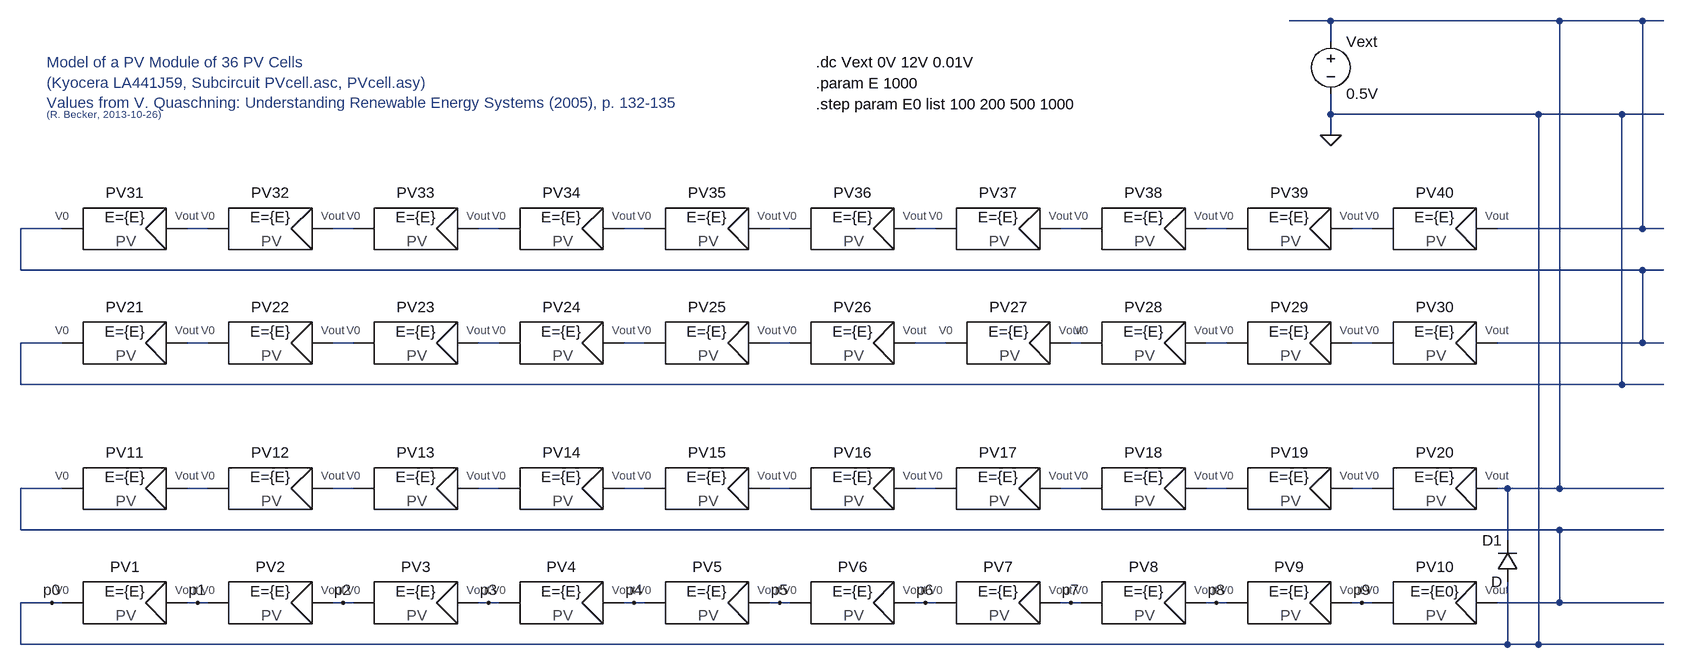
[diagram p0: schematic PVmodule_40Cells_V002.asc]
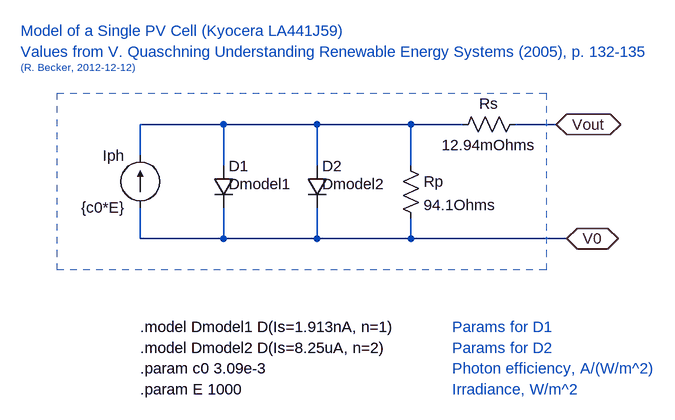
[diagram p1: sub-circuit pvcell.asc]
PVmodule_40Cells_V002.asc, the LTspice schematic file:
Version 4
SHEET 1 2048 1588
WIRE 1440 -16 1376 -16
WIRE 1792 -16 1440 -16
WIRE 1920 -16 1792 -16
WIRE 1952 -16 1920 -16
WIRE 1440 16 1440 -16
WIRE 1440 128 1440 96
WIRE 1760 128 1440 128
WIRE 1888 128 1760 128
WIRE 1952 128 1888 128
WIRE 1440 160 1440 128
WIRE -512 304 -576 304
WIRE -288 304 -320 304
WIRE -64 304 -96 304
WIRE 160 304 128 304
WIRE 384 304 352 304
WIRE 608 304 576 304
WIRE 832 304 800 304
WIRE 1056 304 1024 304
WIRE 1280 304 1248 304
WIRE 1504 304 1472 304
WIRE 1920 304 1920 -16
WIRE 1920 304 1696 304
WIRE 1952 304 1920 304
WIRE -576 368 -576 304
WIRE 1920 368 -576 368
WIRE 1952 368 1920 368
WIRE -512 480 -576 480
WIRE -288 480 -320 480
WIRE -64 480 -96 480
WIRE 160 480 128 480
WIRE 384 480 352 480
WIRE 608 480 576 480
WIRE 848 480 800 480
WIRE 1056 480 1040 480
WIRE 1280 480 1248 480
WIRE 1504 480 1472 480
WIRE 1920 480 1920 368
WIRE 1920 480 1696 480
WIRE 1952 480 1920 480
WIRE -576 544 -576 480
WIRE 1888 544 1888 128
WIRE 1888 544 -576 544
WIRE 1952 544 1888 544
WIRE -512 704 -576 704
WIRE -288 704 -320 704
WIRE -64 704 -96 704
WIRE 160 704 128 704
WIRE 384 704 352 704
WIRE 608 704 576 704
WIRE 832 704 800 704
WIRE 1056 704 1024 704
WIRE 1280 704 1248 704
WIRE 1504 704 1472 704
WIRE 1712 704 1696 704
WIRE 1792 704 1792 -16
WIRE 1792 704 1712 704
WIRE 1952 704 1792 704
WIRE -576 768 -576 704
WIRE 1792 768 -576 768
WIRE 1952 768 1792 768
WIRE 1712 784 1712 704
WIRE -528 880 -576 880
WIRE -512 880 -528 880
WIRE -304 880 -320 880
WIRE -288 880 -304 880
WIRE -80 880 -96 880
WIRE -64 880 -80 880
WIRE 144 880 128 880
WIRE 160 880 144 880
WIRE 368 880 352 880
WIRE 384 880 368 880
WIRE 592 880 576 880
WIRE 608 880 592 880
WIRE 816 880 800 880
WIRE 832 880 816 880
WIRE 1040 880 1024 880
WIRE 1056 880 1040 880
WIRE 1264 880 1248 880
WIRE 1280 880 1264 880
WIRE 1488 880 1472 880
WIRE 1504 880 1488 880
WIRE 1792 880 1792 768
WIRE 1792 880 1696 880
WIRE 1952 880 1792 880
WIRE -576 944 -576 880
WIRE 1712 944 1712 848
WIRE 1712 944 -576 944
WIRE 1760 944 1760 128
WIRE 1760 944 1712 944
WIRE 1952 944 1760 944
FLAG 1440 160 0
FLAG -528 880 p0
FLAG -304 880 p1
FLAG -80 880 p2
FLAG 144 880 p3
FLAG 368 880 p4
FLAG 592 880 p5
FLAG 816 880 p6
FLAG 1040 880 p7
FLAG 1264 880 p8
FLAG 1488 880 p9
SYMBOL PVcell -416 880 R0
WINDOW 39 0 -2 Bottom 2
SYMATTR SpiceLine E={E}
SYMATTR InstName PV1
SYMATTR SpiceModel ""
SYMBOL voltage 1440 0 R0
WINDOW 123 0 0 Left 2
WINDOW 39 0 0 Left 2
SYMATTR InstName Vext
SYMATTR Value 0.5V
SYMBOL PVcell -192 880 R0
WINDOW 39 0 -2 Bottom 2
SYMATTR SpiceLine E={E}
SYMATTR InstName PV2
SYMATTR SpiceModel ""
SYMBOL PVcell 32 880 R0
WINDOW 39 0 -2 Bottom 2
SYMATTR SpiceLine E={E}
SYMATTR InstName PV3
SYMATTR SpiceModel ""
SYMBOL PVcell 256 880 R0
WINDOW 39 0 -2 Bottom 2
SYMATTR SpiceLine E={E}
SYMATTR InstName PV4
SYMATTR SpiceModel ""
SYMBOL PVcell 480 880 R0
WINDOW 39 0 -2 Bottom 2
SYMATTR SpiceLine E={E}
SYMATTR InstName PV5
SYMATTR SpiceModel ""
SYMBOL PVcell 704 880 R0
WINDOW 39 0 -2 Bottom 2
SYMATTR SpiceLine E={E}
SYMATTR InstName PV6
SYMATTR SpiceModel ""
SYMBOL PVcell 928 880 R0
WINDOW 39 0 -2 Bottom 2
SYMATTR SpiceLine E={E}
SYMATTR InstName PV7
SYMATTR SpiceModel ""
SYMBOL PVcell 1152 880 R0
WINDOW 39 0 -2 Bottom 2
SYMATTR SpiceLine E={E}
SYMATTR InstName PV8
SYMATTR SpiceModel ""
SYMBOL PVcell 1376 880 R0
WINDOW 39 0 -2 Bottom 2
SYMATTR SpiceLine E={E}
SYMATTR InstName PV9
SYMATTR SpiceModel ""
SYMBOL PVcell 1600 880 R0
WINDOW 39 0 -2 Bottom 2
SYMATTR SpiceLine E={E0}
SYMATTR InstName PV10
SYMATTR SpiceModel ""
SYMBOL PVcell -416 704 R0
WINDOW 39 0 -2 Bottom 2
SYMATTR SpiceLine E={E}
SYMATTR InstName PV11
SYMATTR SpiceModel ""
SYMBOL PVcell -192 704 R0
WINDOW 39 0 -2 Bottom 2
SYMATTR SpiceLine E={E}
SYMATTR InstName PV12
SYMATTR SpiceModel ""
SYMBOL PVcell 32 704 R0
WINDOW 39 0 -2 Bottom 2
SYMATTR SpiceLine E={E}
SYMATTR InstName PV13
SYMATTR SpiceModel ""
SYMBOL PVcell 256 704 R0
WINDOW 39 0 -2 Bottom 2
SYMATTR SpiceLine E={E}
SYMATTR InstName PV14
SYMATTR SpiceModel ""
SYMBOL PVcell 480 704 R0
WINDOW 39 0 -2 Bottom 2
SYMATTR SpiceLine E={E}
SYMATTR InstName PV15
SYMATTR SpiceModel ""
SYMBOL PVcell 704 704 R0
WINDOW 39 0 -2 Bottom 2
SYMATTR SpiceLine E={E}
SYMATTR InstName PV16
SYMATTR SpiceModel ""
SYMBOL PVcell 928 704 R0
WINDOW 39 0 -2 Bottom 2
SYMATTR SpiceLine E={E}
SYMATTR InstName PV17
SYMATTR SpiceModel ""
SYMBOL PVcell 1152 704 R0
WINDOW 39 0 -2 Bottom 2
SYMATTR SpiceLine E={E}
SYMATTR InstName PV18
SYMATTR SpiceModel ""
SYMBOL PVcell 1376 704 R0
WINDOW 39 0 -2 Bottom 2
SYMATTR SpiceLine E={E}
SYMATTR InstName PV19
SYMATTR SpiceModel ""
SYMBOL PVcell 1600 704 R0
WINDOW 39 0 -2 Bottom 2
SYMATTR SpiceLine E={E}
SYMATTR InstName PV20
SYMATTR SpiceModel ""
SYMBOL PVcell -416 480 R0
WINDOW 39 0 -2 Bottom 2
SYMATTR SpiceLine E={E}
SYMATTR InstName PV21
SYMATTR SpiceModel ""
SYMBOL PVcell -192 480 R0
WINDOW 39 0 -2 Bottom 2
SYMATTR SpiceLine E={E}
SYMATTR InstName PV22
SYMATTR SpiceModel ""
SYMBOL PVcell 32 480 R0
WINDOW 39 0 -2 Bottom 2
SYMATTR SpiceLine E={E}
SYMATTR InstName PV23
SYMATTR SpiceModel ""
SYMBOL PVcell 256 480 R0
WINDOW 39 0 -2 Bottom 2
SYMATTR SpiceLine E={E}
SYMATTR InstName PV24
SYMATTR SpiceModel ""
SYMBOL PVcell 480 480 R0
WINDOW 39 0 -2 Bottom 2
SYMATTR SpiceLine E={E}
SYMATTR InstName PV25
SYMATTR SpiceModel ""
SYMBOL PVcell 704 480 R0
WINDOW 39 0 -2 Bottom 2
SYMATTR SpiceLine E={E}
SYMATTR InstName PV26
SYMATTR SpiceModel ""
SYMBOL PVcell 944 480 R0
WINDOW 39 0 -2 Bottom 2
SYMATTR SpiceLine E={E}
SYMATTR InstName PV27
SYMATTR SpiceModel ""
SYMBOL PVcell 1152 480 R0
WINDOW 39 0 -2 Bottom 2
SYMATTR SpiceLine E={E}
SYMATTR InstName PV28
SYMATTR SpiceModel ""
SYMBOL PVcell 1376 480 R0
WINDOW 39 0 -2 Bottom 2
SYMATTR SpiceLine E={E}
SYMATTR InstName PV29
SYMATTR SpiceModel ""
SYMBOL PVcell 1600 480 R0
WINDOW 39 0 -2 Bottom 2
SYMATTR SpiceLine E={E}
SYMATTR InstName PV30
SYMATTR SpiceModel ""
SYMBOL PVcell -416 304 R0
WINDOW 39 0 -2 Bottom 2
SYMATTR SpiceLine E={E}
SYMATTR InstName PV31
SYMATTR SpiceModel ""
SYMBOL PVcell -192 304 R0
WINDOW 39 0 -2 Bottom 2
SYMATTR SpiceLine E={E}
SYMATTR InstName PV32
SYMATTR SpiceModel ""
SYMBOL PVcell 32 304 R0
WINDOW 39 0 -2 Bottom 2
SYMATTR SpiceLine E={E}
SYMATTR InstName PV33
SYMATTR SpiceModel ""
SYMBOL PVcell 256 304 R0
WINDOW 39 0 -2 Bottom 2
SYMATTR SpiceLine E={E}
SYMATTR InstName PV34
SYMATTR SpiceModel ""
SYMBOL PVcell 480 304 R0
WINDOW 39 0 -2 Bottom 2
SYMATTR SpiceLine E={E}
SYMATTR InstName PV35
SYMATTR SpiceModel ""
SYMBOL PVcell 704 304 R0
WINDOW 39 0 -2 Bottom 2
SYMATTR SpiceLine E={E}
SYMATTR InstName PV36
SYMATTR SpiceModel ""
SYMBOL PVcell 928 304 R0
WINDOW 39 0 -2 Bottom 2
SYMATTR SpiceLine E={E}
SYMATTR InstName PV37
SYMATTR SpiceModel ""
SYMBOL PVcell 1152 304 R0
WINDOW 39 0 -2 Bottom 2
SYMATTR SpiceLine E={E}
SYMATTR InstName PV38
SYMATTR SpiceModel ""
SYMBOL PVcell 1376 304 R0
WINDOW 39 0 -2 Bottom 2
SYMATTR SpiceLine E={E}
SYMATTR InstName PV39
SYMATTR SpiceModel ""
SYMBOL PVcell 1600 304 R0
WINDOW 39 0 -2 Bottom 2
SYMATTR SpiceLine E={E}
SYMATTR InstName PV40
SYMATTR SpiceModel ""
SYMBOL diode 1728 848 R180
WINDOW 0 24 64 Left 2
WINDOW 3 24 0 Left 2
SYMATTR InstName D1
TEXT 648 48 Left 2 !.dc Vext 0V 12V 0.01V
TEXT 648 112 Left 2 !.step param E0 list 100 200 500 1000
TEXT -536 48 Left 2 ;Model of a PV Module of 36 PV Cells \n(Kyocera LA441J59, Subcircuit PVcell.asc, PVcell.asy)\nValues from V. Quaschning: Understanding Renewable Energy Systems (2005), p. 132-135
TEXT -536 128 Left 1 ;(R. Becker, 2013-10-26)
TEXT 648 80 Left 2 !.param E 1000

pvcell.asc, the sub-circuit schematic file:
Version 4
SHEET 1 880 680
WIRE 0 32 -128 32
WIRE 144 32 0 32
WIRE 288 32 144 32
WIRE 368 32 288 32
WIRE 512 32 448 32
WIRE -128 80 -128 32
WIRE 0 96 0 32
WIRE 144 96 144 32
WIRE 288 96 288 32
WIRE -128 208 -128 160
WIRE 0 208 0 160
WIRE 0 208 -128 208
WIRE 144 208 144 160
WIRE 144 208 0 208
WIRE 288 208 288 176
WIRE 288 208 144 208
WIRE 528 208 288 208
FLAG 512 32 Vout
IOPIN 512 32 BiDir
FLAG 528 208 V0
IOPIN 528 208 BiDir
SYMBOL diode -16 96 R0
WINDOW 3 24 28 Left 2
SYMATTR Value Dmodel1
SYMATTR InstName D1
SYMBOL current -128 160 R180
WINDOW 0 24 80 Left 2
WINDOW 3 24 0 Left 2
SYMATTR InstName Iph
SYMATTR Value {c0*E}
SYMBOL diode 128 96 R0
WINDOW 3 24 28 Left 2
SYMATTR Value Dmodel2
SYMATTR InstName D2
SYMBOL res 272 80 R0
SYMATTR InstName Rp
SYMATTR Value 94.1Ohms
SYMBOL res 464 16 R90
WINDOW 0 0 56 VBottom 2
WINDOW 3 32 56 VTop 2
SYMATTR InstName Rs
SYMATTR Value 12.94mOhms
TEXT -128 344 Left 2 !.model Dmodel1 D(Is=1.913nA, n=1)
TEXT -128 376 Left 2 !.model Dmodel2 D(Is=8.25uA, n=2)
TEXT -128 408 Left 2 !.param c0 3.09e-3
TEXT -312 -80 Left 2 ;Values from V. Quaschning Understanding Renewable Energy Systems (2005), p. 132-135
TEXT -312 -112 Left 2 ;Model of a Single PV Cell (Kyocera LA441J59)
TEXT -312 -56 Left 1 ;(R. Becker, 2012-12-12)
TEXT -128 440 Left 2 !.param E 1000
TEXT 352 440 Left 2 ;Irradiance, W/m^2
TEXT 352 408 Left 2 ;Photon efficiency, A/(W/m^2)
TEXT 352 344 Left 2 ;Params for D1
TEXT 352 376 Left 2 ;Params for D2
RECTANGLE Normal 496 256 -256 -16 1

The netlist it stands for:
* PVmodule_40Cells_V002.asc
XPV1 0 p1 pvcell params: E={E}
Vext N001 0 0.5V
XPV2 p1 p2 pvcell params: E={E}
XPV3 p2 p3 pvcell params: E={E}
XPV4 p3 p4 pvcell params: E={E}
XPV5 p4 p5 pvcell params: E={E}
XPV6 p5 p6 pvcell params: E={E}
XPV7 p6 p7 pvcell params: E={E}
XPV8 p7 p8 pvcell params: E={E}
XPV9 p8 p9 pvcell params: E={E}
XPV10 p9 N021 pvcell params: E={E0}
XPV11 N021 N022 pvcell params: E={E}
XPV12 N022 N023 pvcell params: E={E}
XPV13 N023 N024 pvcell params: E={E}
XPV14 N024 N025 pvcell params: E={E}
XPV15 N025 N026 pvcell params: E={E}
XPV16 N026 N027 pvcell params: E={E}
XPV17 N027 N028 pvcell params: E={E}
XPV18 N028 N029 pvcell params: E={E}
XPV19 N029 N030 pvcell params: E={E}
XPV20 N030 N001 pvcell params: E={E}
XPV21 0 N012 pvcell params: E={E}
XPV22 N012 N013 pvcell params: E={E}
XPV23 N013 N014 pvcell params: E={E}
XPV24 N014 N015 pvcell params: E={E}
XPV25 N015 N016 pvcell params: E={E}
XPV26 N016 N017 pvcell params: E={E}
XPV27 N017 N018 pvcell params: E={E}
XPV28 N018 N019 pvcell params: E={E}
XPV29 N019 N020 pvcell params: E={E}
XPV30 N020 N002 pvcell params: E={E}
XPV31 N002 N003 pvcell params: E={E}
XPV32 N003 N004 pvcell params: E={E}
XPV33 N004 N005 pvcell params: E={E}
XPV34 N005 N006 pvcell params: E={E}
XPV35 N006 N007 pvcell params: E={E}
XPV36 N007 N008 pvcell params: E={E}
XPV37 N008 N009 pvcell params: E={E}
XPV38 N009 N010 pvcell params: E={E}
XPV39 N010 N011 pvcell params: E={E}
XPV40 N011 N001 pvcell params: E={E}
D1 0 N001 D

* block symbol definitions
.subckt pvcell V0 Vout
D1 N001 V0 Dmodel1
Iph V0 N001 {c0*E}
D2 N001 V0 Dmodel2
Rp N001 V0 94.1Ohms
Rs Vout N001 12.94mOhms
.model Dmodel1 D(Is=1.913nA, n=1)
.model Dmodel2 D(Is=8.25uA, n=2)
.param c0 3.09e-3
* Values from V. Quaschning Understanding Renewable Energy Systems (2005), p. 132-135
* Model of a Single PV Cell (Kyocera LA441J59)
* (R. Becker, 2012-12-12)
.param E 1000
* Irradiance, W/m^2
* Photon efficiency, A/(W/m^2)
* Params for D1
* Params for D2
.ends pvcell

.model D D
.lib standard.dio
.dc Vext 0V 12V 0.01V
.step param E0 list 100 200 500 1000
* Model of a PV Module of 36 PV Cells
* (Kyocera LA441J59, Subcircuit PVcell.asc, PVcell.asy)
* Values from V. Quaschning: Understanding Renewable Energy Systems (2005), p. 132-135
* (R. Becker, 2013-10-26)
.param E 1000
.backanno
.end